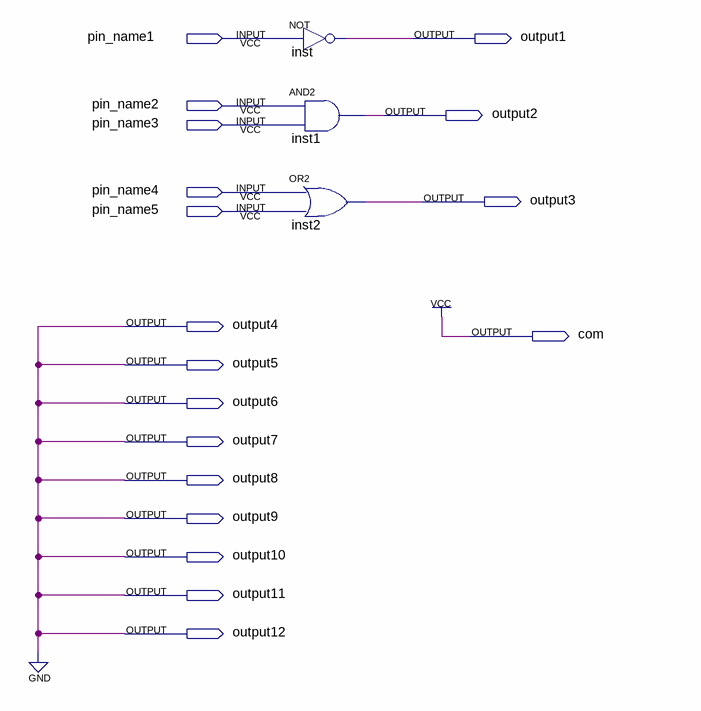
[diagram p0: schematic sheet]
// Quartus schematic board_test.bdf as structural Verilog: 3 symbols, 18 pins
module board_test (
  input  pin_name1,
  input  pin_name2,
  input  pin_name3,
  input  pin_name4,
  input  pin_name5,
  output output1,
  output output2,
  output output3,
  output output4,
  output com,
  output output5,
  output output6,
  output output7,
  output output8,
  output output9,
  output output10,
  output output11,
  output output12
);

  not inst (output1, pin_name1);
  and inst1 (output2, pin_name2, pin_name3);
  or inst2 (output3, pin_name4, pin_name5);

  assign com = 1'b1;
  assign output4 = 1'b0;
  assign output5 = 1'b0;
  assign output6 = 1'b0;
  assign output7 = 1'b0;
  assign output8 = 1'b0;
  assign output9 = 1'b0;
  assign output10 = 1'b0;
  assign output11 = 1'b0;
  assign output12 = 1'b0;
endmodule
